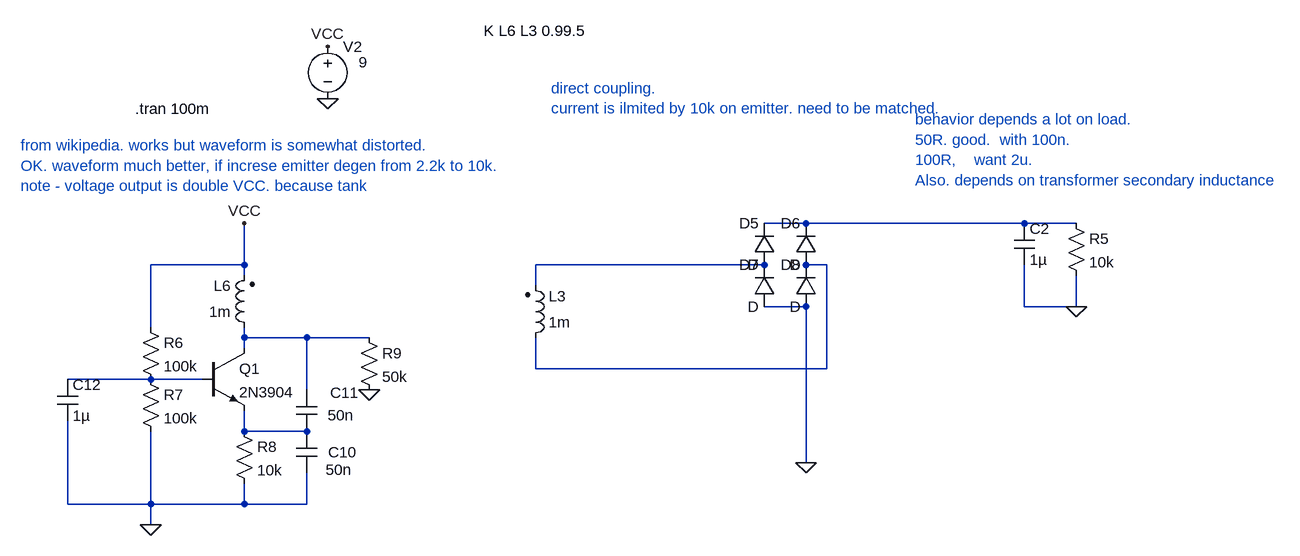
[diagram p0: schematic Draft101.asc]
Draft101.asc, the LTspice schematic file:
Version 4
SHEET 1 5720 1740
WIRE -144 -288 -208 -288
WIRE 192 -288 -144 -288
WIRE 272 -288 192 -288
WIRE -1008 -224 -1008 -288
WIRE -1008 -224 -1152 -224
WIRE -208 -224 -560 -224
WIRE -112 -224 -144 -224
WIRE -1008 -208 -1008 -224
WIRE -560 -192 -560 -224
WIRE -144 -160 -208 -160
WIRE 192 -160 192 -224
WIRE 272 -160 272 -208
WIRE 272 -160 192 -160
WIRE -1152 -128 -1152 -224
WIRE -1008 -112 -1008 -128
WIRE -912 -112 -1008 -112
WIRE -816 -112 -912 -112
WIRE -1008 -96 -1008 -112
WIRE -560 -64 -560 -112
WIRE -112 -64 -112 -224
WIRE -112 -64 -560 -64
WIRE -1152 -48 -1280 -48
WIRE -1072 -48 -1152 -48
WIRE -912 -32 -912 -112
WIRE -1008 32 -1008 0
WIRE -912 32 -1008 32
WIRE -144 80 -144 -160
WIRE -1280 144 -1280 16
WIRE -1152 144 -1152 32
WIRE -1152 144 -1280 144
WIRE -1008 144 -1008 112
WIRE -1008 144 -1152 144
WIRE -912 144 -912 96
WIRE -912 144 -1008 144
WIRE -1152 176 -1152 144
FLAG -880 -480 0
FLAG -880 -560 VCC
FLAG 272 -160 0
FLAG -144 80 0
FLAG -1008 -288 VCC
FLAG -1152 176 0
FLAG -816 -32 0
SYMBOL voltage -880 -576 R0
WINDOW 123 0 0 Left 0
WINDOW 39 0 0 Left 0
WINDOW 3 48 40 Left 2
SYMATTR Value 9
SYMATTR InstName V2
SYMBOL ind2 -576 -96 M180
WINDOW 0 36 80 Left 2
WINDOW 3 36 40 Left 2
SYMATTR InstName L3
SYMATTR Value 1m
SYMATTR Type ind
SYMBOL diode -192 -224 R180
WINDOW 0 24 64 Left 2
WINDOW 3 24 0 Left 2
SYMATTR InstName D5
SYMBOL diode -128 -224 R180
WINDOW 0 24 64 Left 2
WINDOW 3 24 0 Left 2
SYMATTR InstName D6
SYMBOL diode -192 -160 R180
WINDOW 0 24 64 Left 2
WINDOW 3 24 0 Left 2
SYMATTR InstName D7
SYMBOL diode -128 -160 R180
WINDOW 0 24 64 Left 2
WINDOW 3 24 0 Left 2
SYMATTR InstName D8
SYMBOL cap 176 -288 R0
SYMATTR InstName C2
SYMATTR Value 1µ
SYMBOL res 256 -304 R0
SYMATTR InstName R5
SYMATTR Value 10k
SYMBOL ind2 -992 -112 R180
WINDOW 0 36 80 Left 2
WINDOW 3 36 40 Left 2
SYMATTR InstName L6
SYMATTR Value 1m
SYMATTR Type ind
SYMBOL res -1168 -144 R0
SYMATTR InstName R6
SYMATTR Value 100k
SYMBOL res -1168 -64 R0
SYMATTR InstName R7
SYMATTR Value 100k
SYMBOL npn -1072 -96 R0
SYMATTR InstName Q1
SYMATTR Value 2N3904
SYMBOL cap -928 32 R0
WINDOW 0 49 32 Left 2
WINDOW 3 45 59 Left 2
SYMATTR InstName C10
SYMATTR Value 50n
SYMBOL cap -928 -32 R0
WINDOW 0 52 5 Left 2
WINDOW 3 48 39 Left 2
SYMATTR InstName C11
SYMATTR Value 50n
SYMBOL res -1024 16 R0
SYMATTR InstName R8
SYMATTR Value 10k
SYMBOL cap -1296 -48 R0
SYMATTR InstName C12
SYMATTR Value 1µ
SYMBOL res -832 -128 R0
SYMATTR InstName R9
SYMATTR Value 50k
TEXT -640 -584 Left 2 !K L6 L3 0.99.5
TEXT -1176 -464 Left 2 !.tran 100m
TEXT 24 -448 Left 2 ;behavior depends a lot on load. \n50R. good.  with 100n. \n100R,    want 2u.\nAlso. depends on transformer secondary inductance
TEXT -1352 -408 Left 2 ;from wikipedia. works but waveform is somewhat distorted.\nOK. waveform much better, if increse emitter degen from 2.2k to 10k.\nnote - voltage output is double VCC. because tank
TEXT -536 -496 Left 2 ;direct coupling.\ncurrent is ilmited by 10k on emitter. need to be matched.

The netlist it stands for:
* Draft101.asc
V2 VCC 0 9
L3 N003 N002 1m
D5 N002 N001 D
D6 N003 N001 D
D7 0 N002 D
D8 0 N003 D
C2 N001 0 1µ
R5 N001 0 10k
L6 N004 VCC 1m
R6 VCC N005 100k
R7 N005 0 100k
Q1 N004 N005 N006 0 2N3904
C10 N006 0 50n
C11 N004 N006 50n
R8 N006 0 10k
C12 N005 0 1µ
R9 N004 0 50k
.model D D
.lib standard.dio
.model NPN NPN
.model PNP PNP
.lib standard.bjt
K L6 L3 0.99.5
.tran 100m
* behavior depends a lot on load.
* 50R. good.  with 100n.
* 100R,    want 2u.
* Also. depends on transformer secondary inductance
* from wikipedia. works but waveform is somewhat distorted.
* OK. waveform much better, if increse emitter degen from 2.2k to 10k.
* note - voltage output is double VCC. because tank
* direct coupling.
* current is ilmited by 10k on emitter. need to be matched.
.backanno
.end